# EAGLE design Roboduino TQFP-SMD (EAGLE 5.07)
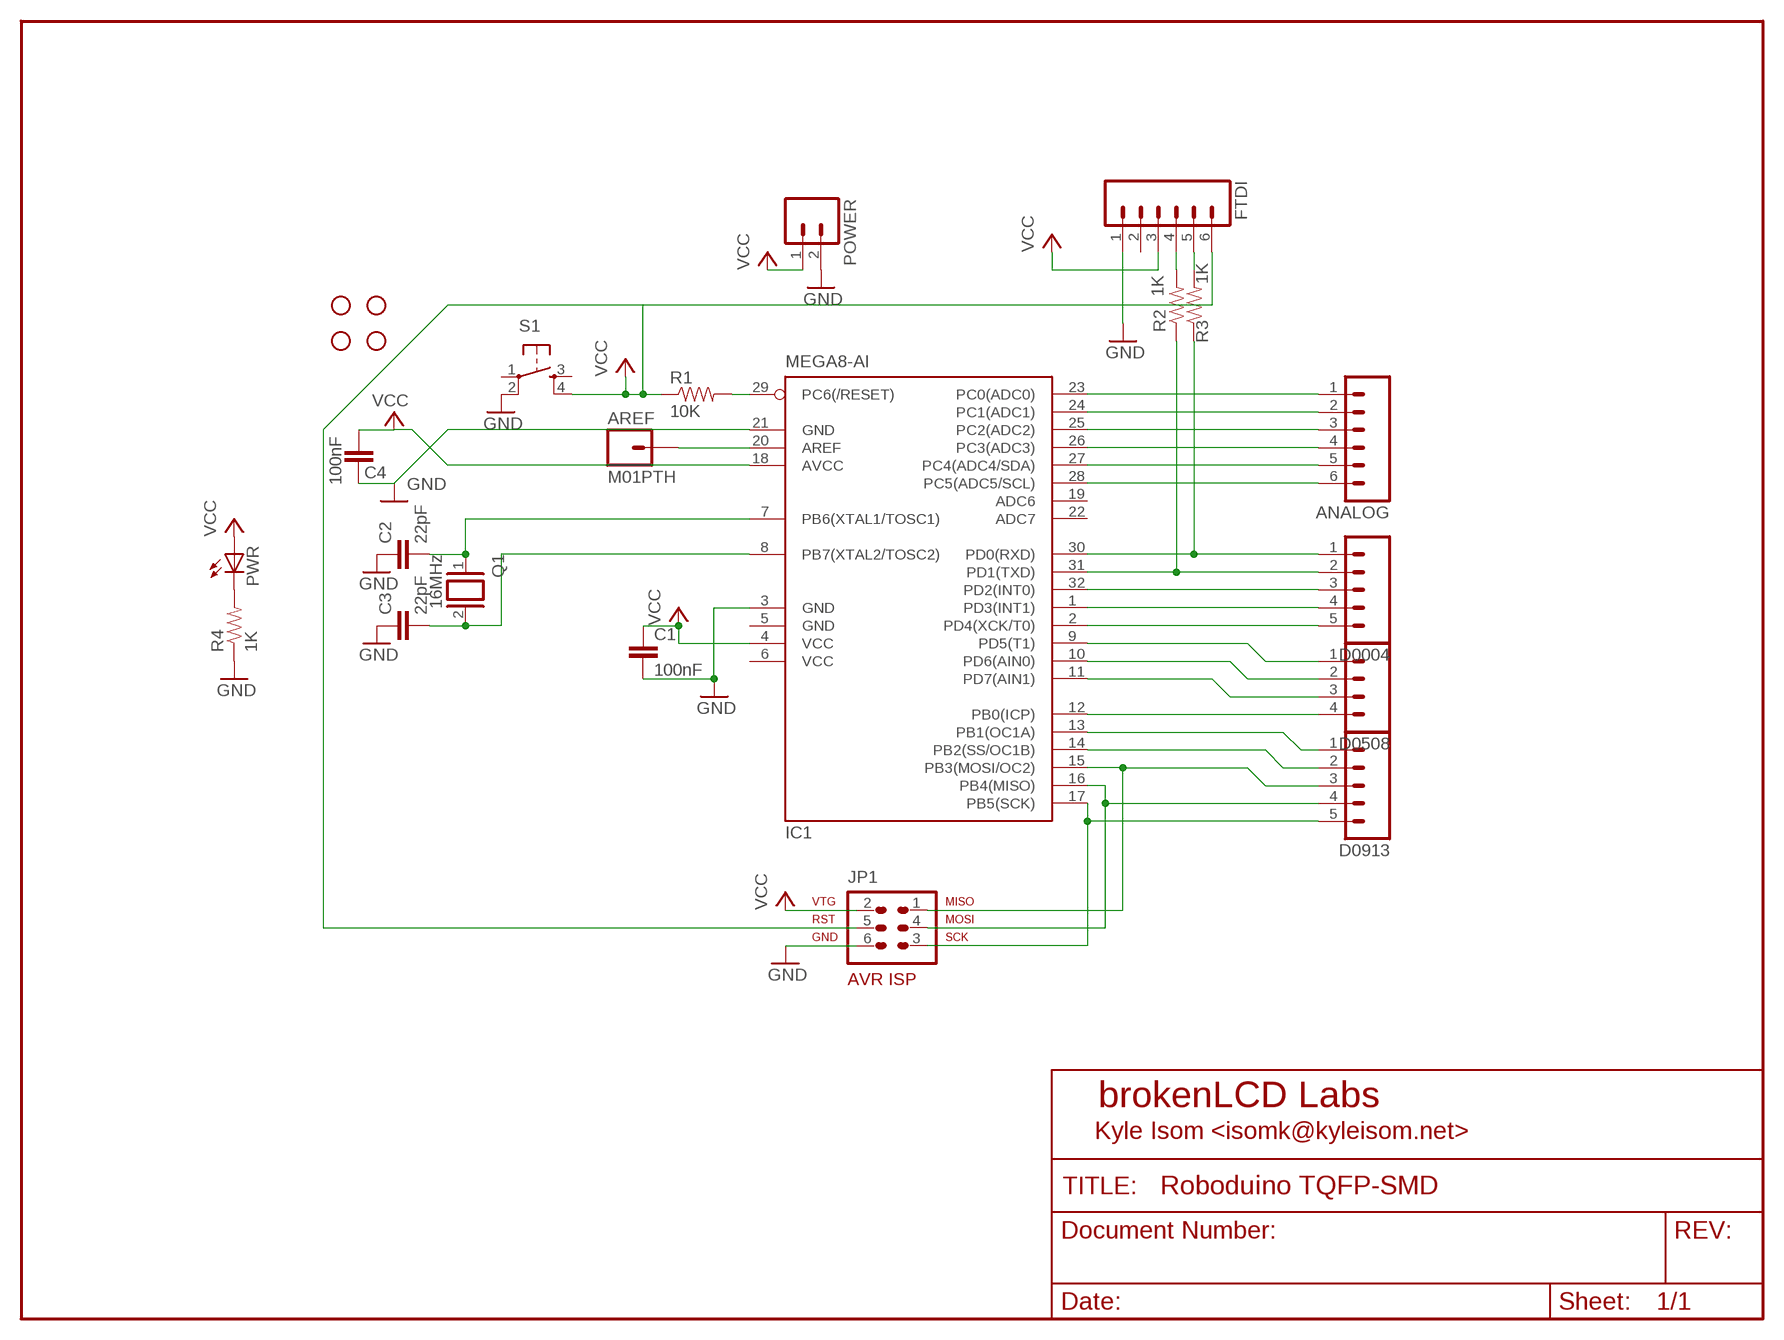
[diagram p0: schematic, sheet 1]

## Parts
ANALOG  M06LOCK  [1X06_LOCK]
AREF  M01PTH  [1X01]
C1  100nF  CAP0603-CAP  [0603-CAP]
C2  22pF  CAP0603-CAP  [0603-CAP]
C3  22pF  CAP0603-CAP  [0603-CAP]
C4  100nF  CAP0603-CAP  [0603-CAP]
D0004  M05LOCK  [1X05_LOCK]
D0508  M04LOCK  [1X04_LOCK]
D0913  M05LOCK  [1X05_LOCK]
FTDI  M06LOCK  [1X06_LOCK]
IC1  MEGA8-AI  [TQFP32-08]
JP1  AVR-ISP-6  [AVR-ISP-6]
POWER  M02LOCK  [1X02_LOCK]
PWR  LEDCHIPLED_0603  [CHIPLED_0603]
Q1  16MHz  XTAL/S  [QS]
R1  10K  RESISTOR0603-RES  [0603-RES]
R2  1K  RESISTOR0603-RES  [0603-RES]
R3  1K  RESISTOR0603-RES  [0603-RES]
R4  1K  RESISTOR0603-RES  [0603-RES]
S1  TAC_SWITCHSMD  [TACTILE_SWITCH_SMD]
U$1  STANDOFF  [STANDOFF]
U$2  STANDOFF  [STANDOFF]
U$3  STANDOFF  [STANDOFF]
U$4  STANDOFF  [STANDOFF]

## Nets
GND: C1.2 C2.1 C3.1 C4.2 FTDI.1 IC1.3(GND) IC1.21(GND) JP1.6 POWER.2 R4.1 S1.2
N$1: IC1.29(PC6(/RESET)) R1.2
N$2: D0508.2 IC1.10(PD6(AIN0))
N$3: C2.2 IC1.7(PB6(XTAL1/TOSC1)) Q1.1
N$4: C3.2 IC1.8(PB7(XTAL2/TOSC2)) Q1.2
N$5: D0004.1 IC1.30(PD0(RXD)) R3.1
N$6: D0004.2 IC1.31(PD1(TXD)) R2.1
N$7: D0004.3 IC1.32(PD2(INT0))
N$8: D0004.4 IC1.1(PD3(INT1))
N$9: D0004.5 IC1.2(PD4(XCK/T0))
N$10: D0913.3 IC1.15(PB3(MOSI/OC2)) JP1.1
N$11: D0913.4 IC1.16(PB4(MISO)) JP1.4
N$12: D0913.5 IC1.17(PB5(SCK)) JP1.3
N$13: D0508.1 IC1.9(PD5(T1))
N$14: D0508.3 IC1.11(PD7(AIN1))
N$15: D0508.4 IC1.12(PB0(ICP))
N$16: D0913.1 IC1.13(PB1(OC1A))
N$17: D0913.2 IC1.14(PB2(SS/OC1B))
N$18: AREF.1 IC1.20(AREF)
N$19: ANALOG.1 IC1.23(PC0(ADC0))
N$20: ANALOG.2 IC1.24(PC1(ADC1))
N$21: ANALOG.3 IC1.25(PC2(ADC2))
N$22: ANALOG.4 IC1.26(PC3(ADC3))
N$23: ANALOG.5 IC1.27(PC4(ADC4/SDA))
N$24: ANALOG.6 IC1.28(PC5(ADC5/SCL))
N$25: PWR.C R4.2
N$26: FTDI.4 R2.2
N$27: FTDI.5 R3.2
VCC: C1.1 C4.1 FTDI.3 FTDI.6 IC1.4(VCC) IC1.18(AVCC) JP1.2 JP1.5 POWER.1 PWR.A R1.1 S1.4
Unconnected: FTDI.2 IC1.19(ADC6) IC1.22(ADC7) S1.1 S1.3

## Notes on the sheet
- brokenLCD Labs
- Kyle Isom <isomk@kyleisom.net>

## Power pins joined to a net without a drawn wire
GND: IC1.5(GND)
VCC: IC1.6(VCC)

## Library data of the parts
ANALOG FTDI = SparkFun:M06: Header 6 Standard 6-pin 0.1" header. Use with straight break away headers (SKU : PRT-00116), right angle break away headers (PRT-00553), swiss pins (PRT-00743), machine pins (PRT-00117), and female headers (PRT-00115). Molex polarized connector foot print use with SKU : PRT-08094 with associated crimp pins and housings. NOTES ON THE VARIANTS LOCK and LOCK_LONGPADS... This footprint was designed to help hold the alignment of a through-hole component (i.e. 6-pin header) while soldering it into place. You may notice that each hole has been shifted either up or down by 0.005 of an inch from it's more standard position (which is a perfectly straight line). This slight alteration caused the pins (the squares in the middle) to touch the edges of the holes. Because they are alternating, it causes a "brace" to hold the component in place. 0.005 has proven to be the perfect amount of "off-center" position when using our standard breakaway headers. Although looks a little odd when you look at the bare footprint, once you have a header in there, the alteration is very hard to notice. Also, if you push a header all the way into place, it is covered up entirely on the bottom side. This idea of altering the position of holes to aid alignment will be further integrated into the Sparkfun Library for other footprints. It can help hold any component with 3 or more connection pins.
AREF = SparkFun:M01: Header 1 Standard 1-pin 0.1" header. Use with straight break away headers (SKU : PRT-00116), right angle break away headers (PRT-00553), swiss pins (PRT-00743), machine pins (PRT-00117), and female headers (PRT-00115).
C1-C4 = SparkFun:CAP: Capacitor Standard 0603 ceramic capacitor, and 0.1" leaded capacitor.
D0004 D0913 = SparkFun:M05: Header 5 Standard 5-pin 0.1" header. Use with straight break away headers (SKU : PRT-00116), right angle break away headers (PRT-00553), swiss pins (PRT-00743), machine pins (PRT-00117), and female headers (PRT-00115). Molex polarized connector foot print use with SKU : PRT-08230 with associated crimp pins and housings.
D0508 = SparkFun:M04: Header 4 Standard 4-pin 0.1" header. Use with straight break away headers (SKU : PRT-00116), right angle break away headers (PRT-00553), swiss pins (PRT-00743), machine pins (PRT-00117), and female headers (PRT-00115). Molex polarized connector foot print use with SKU : PRT-08231 with associated crimp pins and housings.
IC1 = atmel:MEGA8: MICROCONTROLLER 8 Kbytes FLASH, 1 kbytes SRAM, 512 bytes EEPROM, USART, 6-channel 10 bit ADC, 2-channel 8 bit ADC Pin compatible with Atmega48, ATMega88, ATMega168 Source: avr.lbr
JP1 = avr-6:AVR-ISP-6: AVR ISP-6 Serial Programming Header
POWER = SparkFun:M02: Header 2 Standard 2-pin 0.1" header. Use with straight break away headers (SKU : PRT-00116), right angle break away headers (PRT-00553), swiss pins (PRT-00743), machine pins (PRT-00117), and female headers (PRT-00115). Molex polarized connector foot print use with SKU : PRT-08233 with associated crimp pins and housings.
PWR = led:LED: LED OSRAM: - CHIPLED LG R971, LG N971, LY N971, LG Q971, LY Q971, LO R971, LY R971 LH N974, LH R974 LS Q976, LO Q976, LY Q976 LO Q996 - Hyper CHIPLED LW Q18S LB Q993, LB Q99A, LB R99A - SideLED LS A670, LO A670, LY A670, LG A670, LP A670 LB A673, LV A673, LT A673, LW A673 LH A674 LY A675 LS A676, LA A676, LO A676, LY A676, LW A676 LS A679, LY A679, LG A679 - Hyper Micro SIDELED® LS Y876, LA Y876, LO Y876, LY Y876 LT Y87S - SmartLED LW L88C, LW L88S LB L89C, LB L89S, LG L890 LS L89K, LO L89K, LY L89K LS L896, LA L896, LO L896, LY L896 - TOPLED LS T670, LO T670, LY T670, LG T670, LP T670 LSG T670, LSP T670, LSY T670, LOP T670, LYG T670 LG T671, LOG T671, LSG T671 LB T673, LV T673, LT T673, LW T673 LH T674 LS T676, LA T676, LO T676, LY T676, LB T676, LH T676, LSB T676, LW T676 LB T67C, LV T67C, LT T67C, LS T67K, LO T67K, LY T67K, LW E67C LS E67B, LA E67B, LO E67B, LY E67B, LB E67C, LV E67C, LT E67C LW T67C LS T679, LY T679, LG T679 LS T770, LO T770, LY T770, LG T770, LP T770 LB T773, LV T773, LT T773, LW T773 LH T774 LS E675, LA E675, LY E675, LS T675 LS T776, LA T776, LO T776, LY T776, LB T776 LHGB T686 LT T68C, LB T68C - Hyper Mini TOPLED® LB M676 - Mini TOPLED Santana® LG M470 LS M47K, LO M47K, LY M47K Source: http://www.osram.convergy.de LUXEON: - LUMILED® LXK2-PW12-R00, LXK2-PW12-S00, LXK2-PW14-U00, LXK2-PW14-V00 LXK2-PM12-R00, LXK2-PM12-S00, LXK2-PM14-U00 LXK2-PE12-Q00, LXK2-PE12-R00, LXK2-PE12-S00, LXK2-PE14-T00, LXK2-PE14-U00 LXK2-PB12-K00, LXK2-PB12-L00, LXK2-PB12-M00, LXK2-PB14-N00, LXK2-PB14-P00, LXK2-PB14-Q00 LXK2-PR12-L00, LXK2-PR12-M00, LXK2-PR14-Q00, LXK2-PR14-R00 LXK2-PD12-Q00, LXK2-PD12-R00, LXK2-PD12-S00 LXK2-PH12-R00, LXK2-PH12-S00 LXK2-PL12-P00, LXK2-PL12-Q00, LXK2-PL12-R00 Source: www.luxeon.com KINGBRIGHT: KA-3528ASYC Source: www.kingbright.com
Q1 = special:XTAL/S: CRYSTAL
R1-R4 = SparkFun:RESISTOR: Resistor Basic schematic elements and footprints for 0603, 1206, and PTH 1/10th watt (small) resistors.
S1 = SparkFun:TAC_SWITCH: Momentary Switch Button commonly used for reset or general input. Spark Fun Electronics SKU : COM-00097
U$1-U$4 = brokenlcd:STANDOFF

## Board
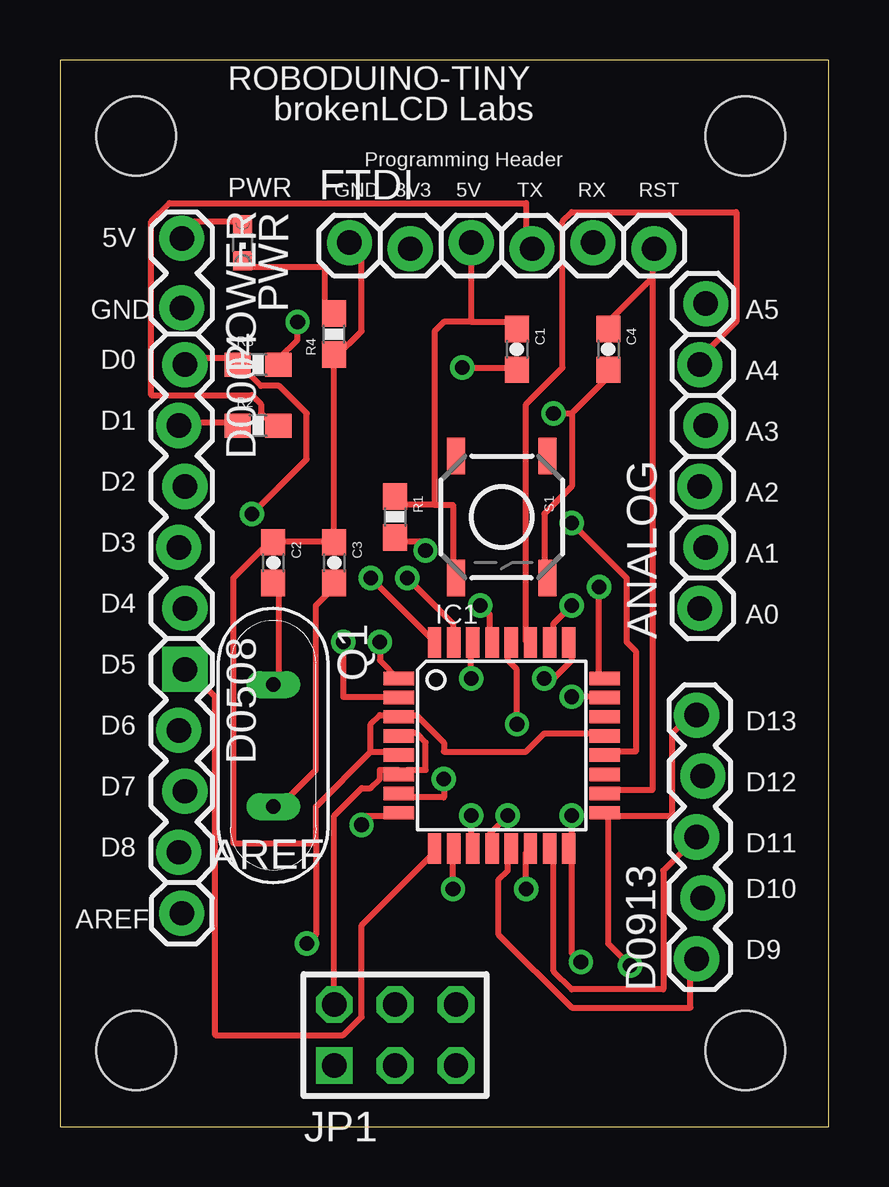
[diagram p1: board, top side]
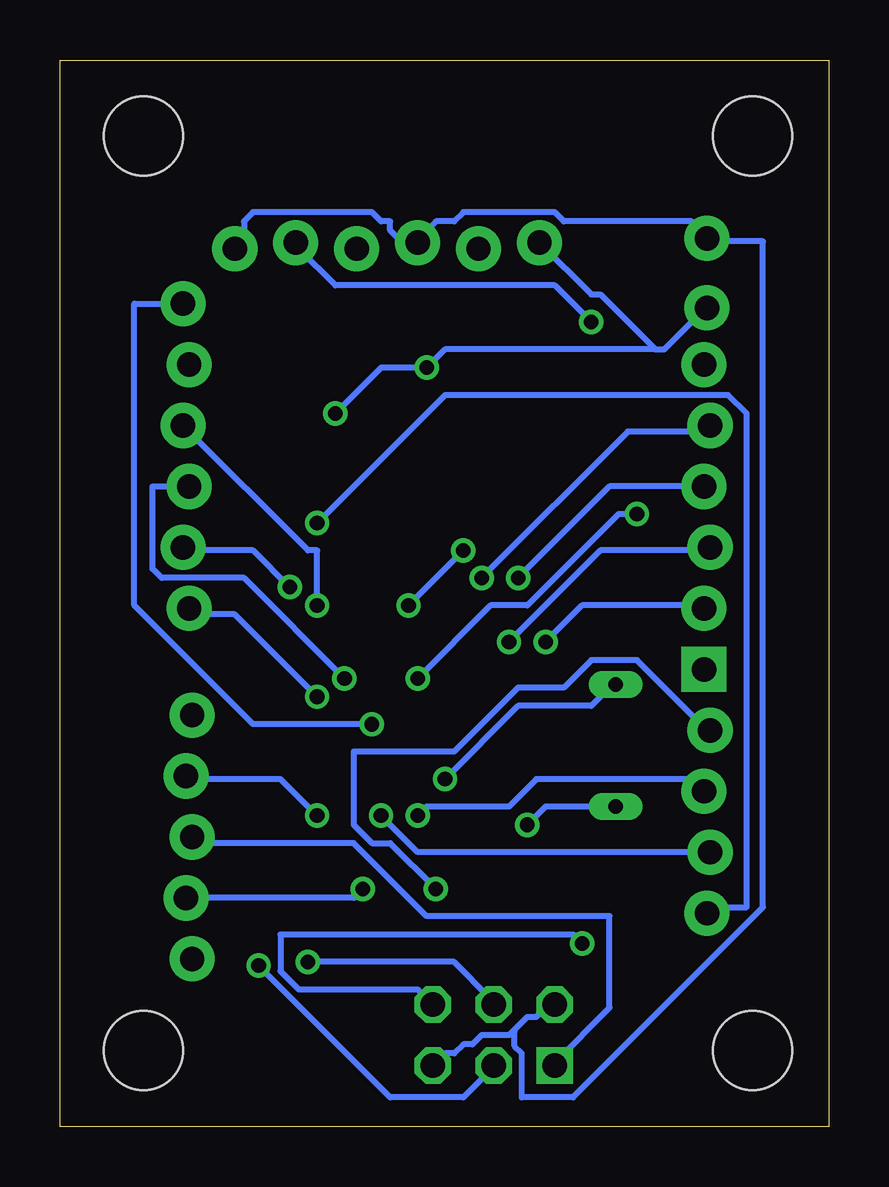
[diagram p2: board, bottom side, seen from below]

Size 32.05 x 44.44 mm. Coordinates in mm from the lower left corner, seen from the top.
Outline: 0,0 32.05,0 32.05,44.44 0,44.44 0,0
Copper layers (1*16): Top 0.035mm / dielectric 1.5mm / Bottom 0.035mm
Design rules "default": minimum track width 10mil, minimum drill 24mil, track to track 8mil, track to pad 8mil, pad to pad 8mil, via to via 8mil, smd to smd 8mil, copper to edge 40mil, drill to drill 8mil, minimum pad ring 10mil, minimum via ring 8mil, stop-mask expansion 4mil, vias tented up to drill 0mil, thermal gap 10mil

### Footprints (pad centres in the part's own frame; a part is rotated, then mirrored left to right if it is on the bottom)
1X06_LOCK = drill 1.016 pad 1.88 round: 1 0,0; 2 2.54,-0.254; 3 5.08,0; 4 7.62,-0.254; 5 10.16,0; 6 12.7,-0.254
1X01 = drill 1.016 pad 1.88 round: 1 0,0
0603-CAP = smd 1.1 x 1: 1 -0.85,0; 2 0.85,0
1X05_LOCK = drill 1.016 pad 1.88 round: 1 0,0.127; 2 2.54,-0.127; 3 5.08,0.127; 4 7.62,-0.127; 5 10.16,0.127
1X04_LOCK = drill 1.016 pad 1.88 square: 1 0,0.127 | drill 1.016 pad 1.88 round: 2 2.54,-0.127; 3 5.08,0.127; 4 7.62,-0.127
TQFP32-08 = smd 1.27 x 0.559: 1 -4.293,2.8; 2 -4.293,2; 3 -4.293,1.2; 4 -4.293,0.4; 5 -4.293,-0.4; 6 -4.293,-1.2; 7 -4.293,-2; 8 -4.293,-2.8; 17 4.293,-2.8; 18 4.293,-2; 19 4.293,-1.2; 20 4.293,-0.4; 21 4.293,0.4; 22 4.293,1.2; 23 4.293,2; 24 4.293,2.8 | smd 0.559 x 1.27: 9 -2.8,-4.293; 10 -2,-4.293; 11 -1.2,-4.293; 12 -0.4,-4.293; 13 0.4,-4.293; 14 1.2,-4.293; 15 2,-4.293; 16 2.8,-4.293; 25 2.8,4.293; 26 2,4.293; 27 1.2,4.293; 28 0.4,4.293; 29 -0.4,4.293; 30 -1.2,4.293; 31 -2,4.293; 32 -2.8,4.293
AVR-ISP-6 = drill 1.016 square: 1 -2.54,-1.27 | drill 1.016 octagon: 2 -2.54,1.27; 3 0,-1.27; 4 0,1.27; 5 2.54,-1.27; 6 2.54,1.27
1X02_LOCK = drill 1.016 pad 1.88 round: 1 -0.178,0; 2 2.718,0
CHIPLED_0603 = smd 0.8 x 0.8: A 0,-0.75; C 0,0.75
QS = drill 0.61 long: 1 -2.54,0; 2 2.54,0
0603-RES = smd 1.1 x 1: 1 -0.85,0; 2 0.85,0
TACTILE_SWITCH_SMD = smd 1.524 x 0.762: 1 -2.54,1.905; 2 2.54,1.905; 3 -2.54,-1.905; 4 2.54,-1.905
STANDOFF = hole 3.302: 0,0

### Placement (x,y rotation side)
ANALOG  26.67,21.59 90 top
AREF  5.08,8.89 0 top
C1  19.05,32.38 270 top
C2  8.89,23.5 270 top
C3  11.43,23.5 270 top
C4  22.86,32.38 270 top
D0004  5.08,31.75 270 top
D0508  5.08,19.05 270 top
D0913  26.67,6.99 90 top
FTDI  12.06,36.83 0 top
IC1  18.41,15.88 0 top
JP1  13.97,3.81 0 top
POWER  5.08,36.83 270 top
PWR  7.62,36.83 180 top
Q1  8.89,15.88 270 top
R1  13.97,25.4 270 top
R2  8.26,29.21 0 top
R3  8.26,31.75 0 top
R4  11.43,33.02 90 top
S1  18.41,25.4 270 top
U$1  3.17,3.17 0 top
U$2  28.57,3.17 0 top
U$3  3.17,41.27 0 top
U$4  28.57,41.27 0 top

### Tracks (layer width: path | path; a pad name or v marks a point on that pad's centre or on a via)
GND  (via drill 0.61)
  Top 0.254: 12.95,15.62 14.1,15.62 IC1.5 | 12.95,15.62 12.95,16.76 13.34,17.14 14.1,17.14 IC1.3 14.48,17.14 14.86,17.14 16,16 16,15.62 19.43,15.62 20.19,16.38 22.48,16.38 IC1.21 | v10.29,7.62 10.67,8 10.67,11.81 | 10.67,11.81 10.67,13.34 12.95,15.62 | 11.43,24.38 9.14,24.38 C2.1 8.76,24.38 7.24,22.86 7.24,11.81 10.67,11.81 | 11.43,24.38 11.43,32 | 11.43,24.38 C3.1 | 11.43,32 12.57,33.15 12.57,36.2 12.19,36.58 FTDI.1 | 11.43,32 R4.1 | 21.34,29.72 22.86,31.24 C4.2 | 21.34,29.72 21.34,26.67 20.19,25.53 20.19,22.86 S1.2 | v16.76,31.62 19.05,31.62 C1.2 | v20.57,29.72 21.34,29.72
  Bottom 0.254: v10.29,7.62 10.67,8 22.86,8 22.86,6.48 22.1,5.71 17.14,5.71 JP1.6 | 7.24,32.38 6.86,32.38 5.33,33.91 POWER.2 | 7.24,32.38 16,32.38 v16.76,31.62 18.67,31.62 v20.57,29.72 | 7.24,32.38 9.53,34.67 9.91,34.67 FTDI.1
N$1  (via drill 0.61)
  Top 0.254: v15.24,24 15.24,24.38 14.1,24.38 R1.2 | v17.53,21.72 17.91,21.34 17.91,20.19 IC1.29
  Bottom 0.254: v15.24,24 v17.53,21.72
N$2  (via drill 0.61)
  Top 0.254: v16.38,9.91 16.38,11.43 IC1.10
  Bottom 0.254: v16.38,9.91 18.29,11.81 19.05,11.81 19.81,12.57 19.81,15.62 15.62,15.62 12.95,18.29 11.05,18.29 9.91,19.43 8,19.43 5.33,16.76 4.95,16.76 D0508.2
N$3  (via drill 0.61)
  Top 0.254: C2.2 9.14,22.48 9.14,18.67 Q1.1 | v16,14.48 16,13.72 14.48,13.72 IC1.7
  Bottom 0.254: v16,14.48 12.95,17.53 9.91,17.53 9.14,18.29 Q1.1
N$4  (via drill 0.61)
  Top 0.254: C3.2 11.43,22.48 10.67,21.72 10.67,14.86 9.14,13.34 Q1.2 | v12.57,12.57 12.57,12.95 14.1,12.95 IC1.8
  Bottom 0.254: v12.57,12.57 11.81,13.34 Q1.2
N$5  (via drill 0.61)
  Top 0.254: D0004.1 5.33,32 7.24,32 R3.1 7.62,31.62 8.38,30.86 9.14,30.86 10.29,29.72 10.29,27.81 v8,25.53 | v17.14,18.67 17.14,19.81 IC1.30
  Bottom 0.254: v17.14,18.67 14.1,21.72 12.57,21.72 8.76,25.53 v8,25.53
N$6  (via drill 0.61)
  Top 0.254: R2.1 7.24,29.34 4.95,29.34 D0004.2 | v14.48,22.86 16.38,20.95 16.38,20.19 IC1.31
  Bottom 0.254: v14.48,22.86 8.38,28.96 4.95,28.96 D0004.2
N$7  (via drill 0.61)
  Top 0.254: v12.95,22.86 15.62,20.19 IC1.32
  Bottom 0.254: v12.95,22.86 9.14,26.67 D0004.3
N$8  (via drill 0.61)
  Top 0.254: v13.34,20.19 13.34,19.43 14.1,18.67 IC1.1
  Bottom 0.254: v13.34,20.19 9.53,24 4.95,24 D0004.4
N$9  (via drill 0.61)
  Top 0.254: v11.81,20.19 11.81,17.91 14.1,17.91 IC1.2
  Bottom 0.254: v11.81,20.19 10.29,21.72 5.33,21.72 D0004.5
N$10
  Top 0.254: IC1.15 20.57,11.43 20.57,6.48 21.34,5.71 25.15,5.71 25.15,10.67 D0913.3
  Bottom 0.254: JP1.1 11.43,2.67 9.14,4.95 9.14,8.76 16.76,8.76 19.81,11.81 26.29,11.81 D0913.3
N$11  (via drill 0.61)
  Top 0.254: v21.34,12.95 21.34,11.81 IC1.16 21.34,11.43 21.34,7.24 v21.72,6.86
  Bottom 0.254: v21.34,12.95 22.86,14.48 26.67,14.48 D0913.4 | v21.72,6.86 15.62,6.86 14.1,5.33 JP1.4
N$12  (via drill 0.61)
  Top 0.254: D0913.5 26.29,17.14 25.53,16.38 25.53,12.95 22.86,12.95 IC1.17 22.86,12.8 22.86,7.62 v23.77,6.71
  Bottom 0.254: v23.77,6.71 18.29,1.22 15.24,1.22 14.02,2.44 JP1.3
N$13
  Top 0.254: IC1.9 15.62,11.43 12.57,8.38 12.57,4.57 11.81,3.81 6.48,3.81 6.48,17.91 5.33,19.05 D0508.1
N$14  (via drill 0.61)
  Top 0.254: v17.14,12.95 17.14,11.81 IC1.11
  Bottom 0.254: v17.14,12.95 16.76,13.34 13.34,13.34 12.19,14.48 5.71,14.48 D0508.3
N$15  (via drill 0.61)
  Top 0.254: v18.67,12.95 17.91,12.19 17.91,11.81 IC1.12
  Bottom 0.254: v18.67,12.95 17.14,11.43 D0508.4
N$16
  Top 0.254: IC1.13 18.67,11.43 18.67,10.67 18.29,10.29 18.29,8 21.34,4.95 26.29,4.95 26.29,6.86 D0913.1
N$17  (via drill 0.61)
  Top 0.254: v19.43,9.91 19.43,11.43 IC1.14
  Bottom 0.254: v19.43,9.91 19.81,9.53 D0913.2
N$18  (via drill 0.61)
  Top 0.254: v21.34,25.15 23.62,22.86 23.62,20.19 24,19.81 24,15.62 22.86,15.62 IC1.20
  Bottom 0.254: v21.34,25.15 16,30.48 4.19,30.48 3.43,29.72 3.43,9.14 4.95,9.14 AREF.1
N$19  (via drill 0.61)
  Top 0.254: v21.34,17.91 22.48,17.91 IC1.23
  Bottom 0.254: v21.34,17.91 24.77,21.34 26.67,21.34 ANALOG.1
N$20  (via drill 0.61)
  Top 0.254: v22.48,22.48 22.48,18.67 IC1.24
  Bottom 0.254: v22.48,22.48 24,24 26.67,24 ANALOG.2
N$21  (via drill 0.61)
  Top 0.254: v20.19,18.67 20.57,18.67 21.34,19.43 21.34,19.81 IC1.25
  Bottom 0.254: v20.19,18.67 24.38,22.86 27.81,22.86 28.19,23.24 28.19,26.67 ANALOG.3
N$22  (via drill 0.61)
  Top 0.254: v21.34,21.72 20.57,20.95 20.57,20.19 IC1.26
  Bottom 0.254: v21.34,21.72 21.34,24 21.72,24 ANALOG.4
N$23
  Top 0.254: IC1.27 19.43,20.19 19.43,30.1 20.95,31.62 20.95,37.72 21.34,38.1 28.19,38.1 28.19,33.53 26.67,32 ANALOG.5
N$24  (via drill 0.61)
  Top 0.254: v19.05,16.76 19.05,19.05 18.67,19.43 18.67,19.81 IC1.28
  Bottom 0.254: v19.05,16.76 24,16.76 28.96,21.72 28.96,34.29 ANALOG.6
N$25
  Top 0.254: PWR.C 7.62,35.81 11.05,35.81 11.05,34.29 11.43,33.91 R4.2
N$26
  Top 0.254: R2.2 8.76,29.34 8.38,29.72 8.38,30.1 8,30.48 3.81,30.48 3.81,37.72 4.57,38.48 19.43,38.48 19.43,36.58 FTDI.4
N$27  (via drill 0.61)
  Top 0.254: v9.91,33.53 9.91,32.77 9.14,32 R3.2
  Bottom 0.254: v9.91,33.53 11.43,35.05 20.57,35.05 22.1,36.58 FTDI.5
VCC
  Top 0.254: PWR.A 7.62,37.72 4.95,37.72 4.95,37.34 POWER.1 | 15.62,25.91 16.38,25.91 16.38,22.86 S1.4 | 15.62,25.91 14.1,25.91 R1.1 | 17.14,33.53 19.05,33.53 C1.1 | FTDI.3 17.14,33.53 | 15.62,25.91 15.62,33.15 16,33.53 17.14,33.53 | IC1.4 14.48,16.38 14.86,16.38 15.24,16 15.24,14.86 14.48,14.86 IC1.6 14.1,14.86 13.34,14.86 13.34,14.48 12.95,14.1 12.57,14.1 11.43,12.95 JP1.2 | 24.69,35.36 22.86,33.53 C4.1 | 24.69,35.36 24.69,36.58 FTDI.6 | 24.69,35.36 24.69,14.02 22.86,14.02 IC1.18
  Bottom 0.254: 17.14,36.96 16.76,36.96 16.76,37.34 16.38,37.72 15.62,37.72 15.24,38.1 11.43,38.1 11.05,37.72 5.71,37.72 5.33,37.34 POWER.1 4.88,36.88 2.74,36.88 2.74,9.14 10.67,1.22 12.8,1.22 12.8,3.05 13.11,3.35 13.11,3.96 13.14,4 | 13.14,4 12.57,4.57 12.19,4.57 11.81,4.95 11.43,4.95 JP1.2 | 13.14,4 13.34,3.81 14.48,3.81 14.86,3.43 15.24,3.43 15.62,3.05 16,3.05 JP1.5 | 17.14,36.96 17.91,36.96 18.29,37.34 18.29,37.72 18.67,37.72 19.05,38.1 24,38.1 24.38,37.72 24.38,36.58 FTDI.6 | 17.14,36.96 FTDI.3

### Text on the board
tPlace: ROBODUINO-TINY | brokenLCD Labs | Programming Header | PWR | GND | 3V3 | 5V | TX | RX | RST | 5V | GND | A5 | D0 | A4 | D1 | A3 | D2 | A2 | D3 | A1 | D4 | A0 | D5 | D6 | D13 | D7 | D12 | D8 | D11 | D10 | AREF | D9